# EasyEDA Pro project C8T6实验板.epro

# Schematic Schematic1
Create Date: 2023-04-12; Page Name: P1; Project Name: c8t6; Schematic Name: Schematic1; Update Date: 2023-06-14; Company: 嘉立创EDA; Page Size: A4; Version: V1.0
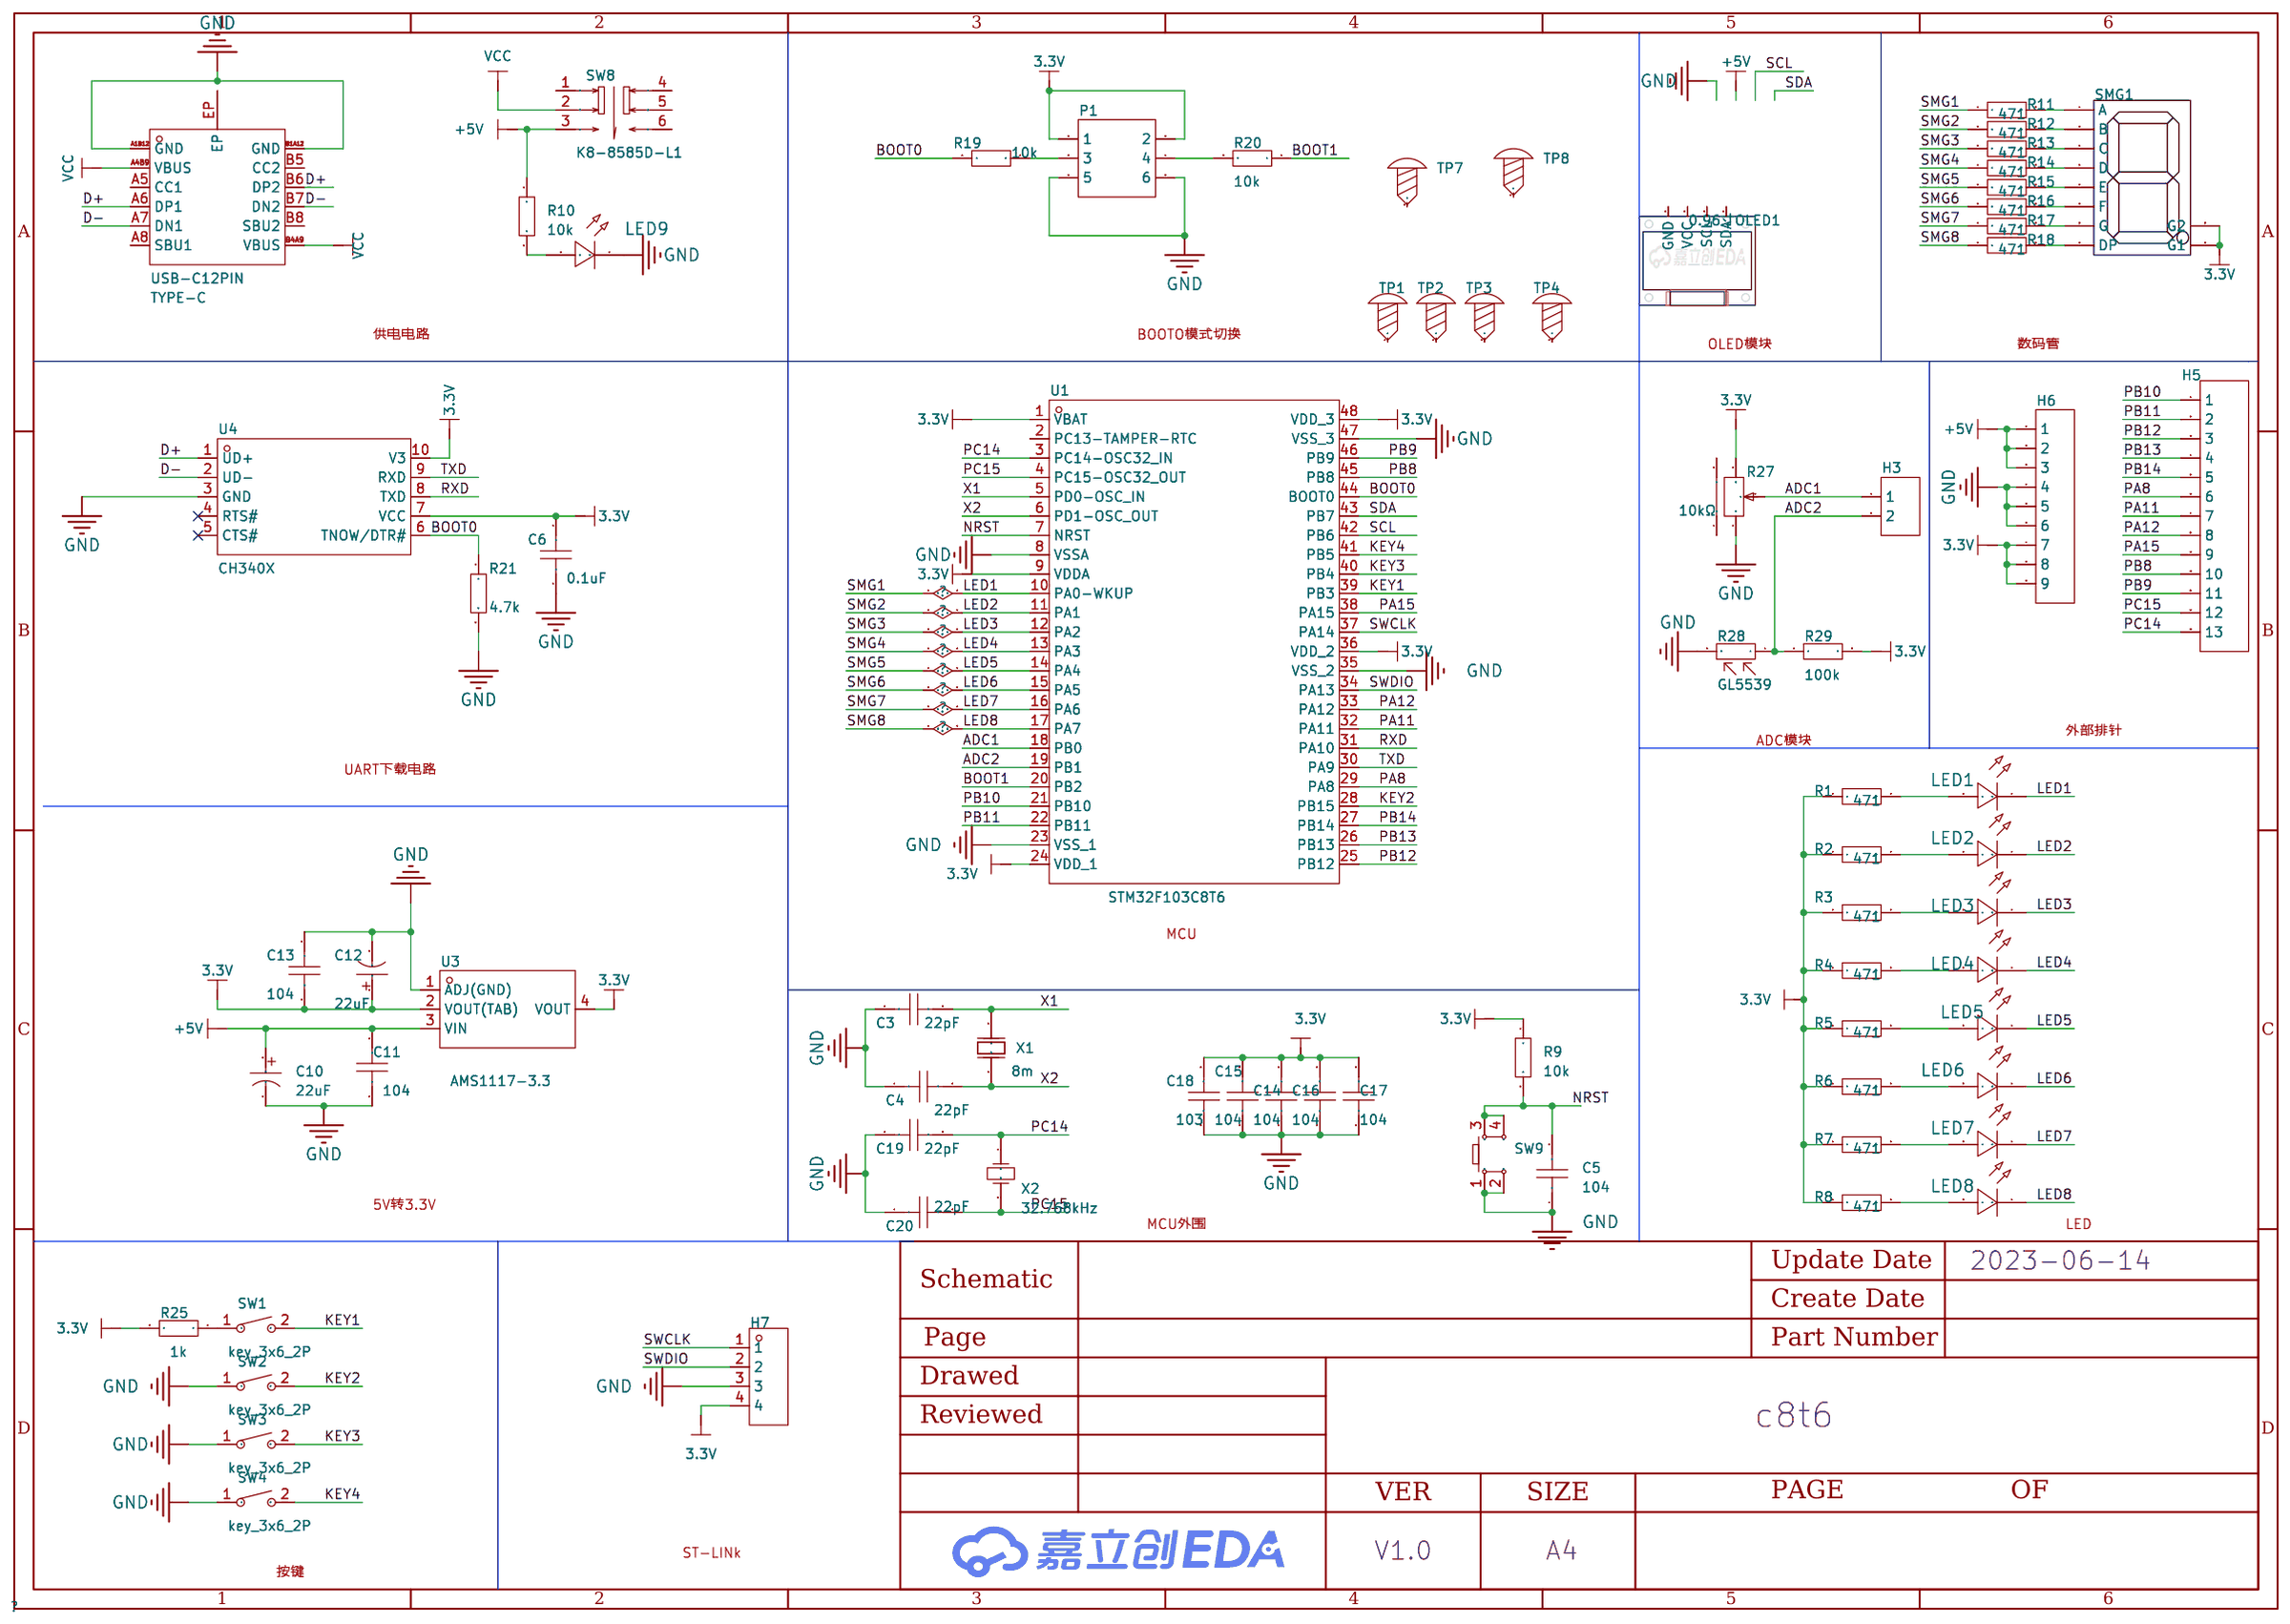
[diagram p0: schematic sheet]

## Parts
0.96寸OLED1  -  [0.96OLED_4P]
C3  22pF  [C0805]
C4  22pF  [C0805]
C5  104  [C0805]
C6  0.1uF  [C0805]
C10  22uF  [CAP-SMD_BD6.3-L6.6-W6.6-FD]
C11  104  [C0805]
C12  22uF  [CAP-SMD_BD6.3-L6.6-W6.6-FD]
C13  104  [C0805]
C14  104  [C0805]
C15  104  [C0805]
C16  104  [C0805]
C17  104  [C0805]
C18  103  [C0805]
C19  22pF  [C0805]
C20  22pF  [C0805]
H3  -  [HDR-TH_2P-P2.54-V-F]
H5  -  [HDR-TH_13P-P2.54-V-F]
H6  -  [HDR-TH_9P-P2.54-V-F-1]
H7  -  [HDR-TH_4P-P2.54-V-M]
LED1  -  [LED_0805]
LED2  -  [LED_0805]
LED3  -  [LED_0805]
LED4  -  [LED_0805]
LED5  -  [LED_0805]
LED6  -  [LED_0805]
LED7  -  [LED_0805]
LED8  -  [LED_0805]
LED9  -  [LED_0805]
P1  -  [HDR-TH_6P-P2.54-V-F-R2-C3-S2.54]
R1  471  [R0805]
R2  471  [R0805]
R3  471  [R0805]
R4  471  [R0805]
R5  471  [R0805]
R6  471  [R0805]
R7  471  [R0805]
R8  471  [R0805]
R9  10k  [R0805]
R10  10k  [R0805]
R11  471  [R0805]
R12  471  [R0805]
R13  471  [R0805]
R14  471  [R0805]
R15  471  [R0805]
R16  471  [R0805]
R17  471  [R0805]
R18  471  [R0805]
R19  10k  [R0805]
R20  10k  [R0805]
R21  4.7k  [R0805]
R25  1k  [R0805]
R27  10kΩ  [RES-ADJ-TH_RK09K1130AJ3]
R28  GL5539  [RES-TH_L5.1-W4.3-P3.40-D0.5]
R29  100k  [R0805]
SMG1  -  [LED-SEG-TH_10P-L12.6-W19.0-P2.54-S15.24-BL]
SW1  key_3x6_2P  [SW-SMD_L6.0-W3.5-LS8.0]
SW2  key_3x6_2P  [SW-SMD_L6.0-W3.5-LS8.0]
SW3  key_3x6_2P  [SW-SMD_L6.0-W3.5-LS8.0]
SW4  key_3x6_2P  [SW-SMD_L6.0-W3.5-LS8.0]
SW8  K8-8585D-L1  [KEY-TH_6P-L8.5-W8.5-P2.54]
SW9  -  [SW-SMD_4P-L6.0-W6.0-P4.50-LS9.0-2]
TP1  -  [M4螺丝]
TP2  -  [M4螺丝]
TP3  -  [M4螺丝]
TP4  -  [M4螺丝]
TP7  -  [M2螺丝]
TP8  -  [M2螺丝]
U1  STM32F103C8T6  [LQFP-48_L7.0-W7.0-P0.50-LS9.0-BL]
U3  AMS1117-3.3  [SOT-223_L6.5-W3.5-P2.30-LS7.0-BR]
U4  CH340X  [MSOP-10_L3.0-W3.0-P0.50-LS5.0-BL]
USB-C12PIN  TYPE-C  [USB-C-SMD_TYPE-C-16P-1]
X1  8m  [HC-49US_L11.5-W4.5-P4.88]
X2  32.768kHz  [OSC-TH_BD2.0-P0.70-D0.3]

## Library data of the parts
0.96寸OLED1 = 0.96OLED模块_4P: Supplier Footprint: 插件
C3-C6 C11 C13-C20 = CAP_0603: Supplier Footprint: 0603
C10 C12 = CK0J221M-CRE54_C3001236: 容值:220uF;精度:±20%;额定电压:6.3V;纹波电流:67mA@120Hz;; LCSC Part Name: 220uF ±20% 6.3V; Supplier Part: C3001236; Manufacturer: ROQANG(容强); Manufacturer Part: CK0J221M-CRE54; Supplier Footprint: SMD,D6.3xL5.4mm; JLCPCB Part Class: Extended Part; Datasheet: https://atta.szlcsc.com/upload/public/pdf/source/20220429/3961170169213FF6C34E47C660BD429F.pdf; Supplier: LCSC; Tolerance: ±20%; Rated Voltage: 6.3V; φD: 6.3mm; L: 5.4mm; Ripple Current: 67mA@120Hz; Lifetime @ Temp: 2000hrs@105℃; Operating Temperature: -55℃~+105℃
H3 = HDR-F_2.54_1x2P: Supplier Part: C49661; Supplier Footprint: 插件
H5 = HDR-F_2.54_1x13P: Supplier Part: C52709; Supplier Footprint: 插件
H6 = HDR-F_2.54_1x9P: Supplier Part: C39576; Supplier Footprint: 插件
H7 = HDR-M_2.54_1x4P: Supplier Part: C492403; Supplier Footprint: 插件
LED1-LED9 = LED_0603-R: Supplier Footprint: 0603
P1 = HDR-F_2.54_2x3: Supplier Part: C92272; Supplier Footprint: 插件
R1-R21 R25 R29 = Res_0603: Supplier Footprint: 0603
R27 = RK09K1130AP5: 阻值:10kΩ;精度:±20%;功率:50mW;; LCSC Part Name: 10kΩ ±20%; Supplier Part: C470295; Manufacturer: ALPSALPINE(阿尔卑斯阿尔派); Supplier Footprint: 插件; JLCPCB Part Class: 扩展库; Datasheet: https://atta.szlcsc.com/upload/public/pdf/source/20191216/C470295_B7C088B596733789BB6A603002A3F140.pdf; Supplier: LCSC; Tolerance: ±20%; Power(Watts): 50mW; Rated Voltage: 20V
R28 = GL5539: 光谱峰值(波长):540nm;最大电压:150V;亮电阻 @ 10Lux:30kΩ~90kΩ;暗电阻:10MΩ;; Supplier Part: C125630; Manufacturer: 森霸; Supplier Footprint: 插件,P=3mm; JLCPCB Part Class: 扩展库; Datasheet: https://atta.szlcsc.com/upload/public/pdf/source/20170810/C125630_1502335366924879946.pdf; Supplier: LCSC; Spectral Peak: 540nm; Applied Voltage: 150V; Illuminated Resistance @ 10Lux: 30kΩ~90kΩ; Dark Resistance: 10MΩ
SMG1 = LED_SEG_TH_0.56x1: Supplier Footprint: 插件
SW1-SW4 = key_3x6_2P: Supplier Part: C9900016923; JLCPCB Part Class: Extended Part; Datasheet: https://atta.szlcsc.comnull; Supplier: LCSC
SW8 = K8-8585D-L1: 触点电流:100mA;额定电压 (AC):-;额定电压 (DC):30V;绝缘电阻:100mΩ;安装方式:直插;自锁/无锁:自锁;按键形状:矩形柱塞;按键/盖帽颜色:黑色;带灯:无;引脚样式:PC引脚;作用力:240gf@±80gf;防护等级:-;工作温度:-25℃~+80℃;机械寿命:100000;; Supplier Part: C111758; Manufacturer: 韩国韩荣; Supplier Footprint: 插件; JLCPCB Part Class: 扩展库; Datasheet: https://atta.szlcsc.com/upload/public/pdf/source/20210810/2AEDE88915041A762602CF2B2D644A32.pdf; Supplier: LCSC; Contact Current: 100mA; Voltage Rating (DC): 30V; Insulation Resistance: 100mΩ; Mounting Style: 直插; Self Lock / No Lock: 自锁; Actuator Style: 矩形柱塞; Actuator/Cap Color: 黑色; With Lamp: 无; Pin Style: PC引脚; Operating Force: 240gf@±80gf; Operating Temperature: -25℃~+80℃; Mechanical Life: 100000
SW9 = Key_SMD_6x6x6.5: Supplier Footprint: SMD
TP1-TP4 = M4螺丝: Supplier Footprint: 插件
TP7 TP8 = M3螺丝: Supplier Footprint: 插件
U1 = STM32F103C8T6: 工作电压:2V ~ 3.6V;主频（MAX):72MHz;; Supplier Part: C8734; Manufacturer: ST(意法半导体); Supplier Footprint: LQFP-48_7x7x05P; JLCPCB Part Class: 基础库; Datasheet: https://atta.szlcsc.com/upload/public/pdf/source/20140724/1457707174202.pdf; Supplier: LCSC; UART/USART: 3 USART; USB Device: 1; PWM: 13; I2C（SMBUS/PMBUS）: 2; Voltage - Supply (Vcc/Vdd): 2V ~ 3.6V; CAN: 1; A/D: 10x12bit; Program Memory Size: 64KB; RAM Size: 20KB; Speed: 72MHz; Number of I/O: 37
U3 = AMS1117-3.3_C347256: 静态电流(Iq):-;输出类型:固定;最大输入电压:18V;输出电压(可调):-;压降(max):1.3V @ 1A;输出电压(固定):3.3V;; LCSC Part Name: 低压差线性稳压(LDO); Supplier Part: C347256; Manufacturer: UMW(友台半导体); Supplier Footprint: SOT-89; JLCPCB Part Class: 扩展库; Datasheet: https://atta.szlcsc.com/upload/public/pdf/source/20211011/50CC665C22E3A66C08379A4A74BDA25C.pdf; Supplier: LCSC; Ripple Rejection (PSRR): 60dB(120Hz); Output Configuration: 正; Current - Supply (Max): 10mA; Output Current (Max): 1A; Output Type: 固定; Number of Output Channels: 1; Operating Temperature: -40℃~125℃; Voltage - Input (Max): 18V; Voltage Dropout (Max): 1.3V @ 1A; Voltage - Output (Fixed): 3.3V
U4 = CH340X: Supplier Part: C3035748; Manufacturer: WCH(南京沁恒); Supplier Footprint: MSOP-10; JLCPCB Part Class: 扩展库; Datasheet: https://atta.szlcsc.comnull; Supplier: LCSC
USB-C12PIN = TYPE-C_C9900008394: Supplier Part: C9900008394; Supplier Footprint: TYPE-C-16P; JLCPCB Part Class: Extended Part; Datasheet: 2022-02-23/91586W/67ceeeb81a9f4c1f8ea00a3628213c3d/USBC16P.pdf; Supplier: LCSC
X1 = XIHCCCNANF-11.0592: 频率:-;负载电容:-;; Supplier Part: C358645; Manufacturer: TAITIEN(泰艺电子); Supplier Footprint: HC-49S; JLCPCB Part Class: 扩展库; Datasheet: https://atta.szlcsc.com/upload/public/pdf/source/20190107/C358645_229D1BE99A621A695563BD15EF2D24F1.pdf; Supplier: LCSC
X2 = X206032768KGA2SC: 频率:32.768kHz;频率公差:±5ppm;负载电容:12.5pF;; LCSC Part Name: 32.768kHz ±5ppm 12.5pF YT-26; Supplier Part: C13712; Manufacturer: YXC(扬兴晶振); Supplier Footprint: DT-26; JLCPCB Part Class: Extended Part; Datasheet: https://atta.szlcsc.com/upload/public/pdf/source/20210329/C13712_F7F11DC87370623B2CDEB0B445E6F76E.pdf; Supplier: LCSC; Crystal Type: 圆柱体晶振; Frequency Tolerance: ±5ppm; Load Capacitance: 12.5pF; Operating Temperature: -20℃~+70℃

## Nets
3.3V: C6.2 C12.1 C13.2 C14.2 C15.2 C16.2 C17.2 C18.2 H6.7 H6.8 H6.9 H7.4 P1.1 P1.2 R1.1 R2.1 R3.1 R4.1 R5.1 R6.1 R7.1 R8.1 R9.1 R25.2 R27.3 R29.2 SMG1.3(G1) SMG1.8(G2) U1.1(VBAT) U1.9(VDDA) U1.24(VDD_1) U1.36(VDD_2) U1.48(VDD_3) U3.2(VOUT(TAB)) U3.4(VOUT) U4.7(VCC) U4.10(V3)
+5V: C10.1 C11.2 H6.1 H6.2 H6.3 R10.1 SW8.3 U3.3(VIN)
GND: C3.1 C4.1 C5.1 C6.1 C10.2 C11.1 C12.2 C13.1 C14.1 C15.1 C16.1 C17.1 C18.1 C19.1 C20.1 H6.4 H6.5 H6.6 H7.3 LED9.1(C) P1.5 P1.6 R21.2 R27.1 R28.2 SW2.1 SW3.1 SW4.1 SW9.1 SW9.2 U1.8(VSSA) U1.23(VSS_1) U1.35(VSS_2) U1.47(VSS_3) U3.1(ADJ(GND)) U4.3(GND) USB-C12PIN.A1B12(GND) USB-C12PIN.B1A12(GND)
VCC: SW8.2 USB-C12PIN.A4B9(VBUS) USB-C12PIN.B4A9(VBUS)
ADC1: H3.1 R27.2 U1.18(PB0)
ADC2: H3.2 R28.1 R29.1 U1.19(PB1)
BOOT0: R19.2 R21.1 U1.44(BOOT0) U4.6(TNOW/DTR#)
BOOT1: R20.1 U1.20(PB2)
D+: U4.1(UD+) USB-C12PIN.A6(DP1) USB-C12PIN.B6(DP2)
D-: U4.2(UD-) USB-C12PIN.A7(DN1) USB-C12PIN.B7(DN2)
KEY1: SW1.2 U1.39(PB3)
KEY2: SW2.2 U1.28(PB15)
KEY3: SW3.2 U1.40(PB4)
KEY4: SW4.2 U1.41(PB5)
LED1: LED1.1(C) R11.1 U1.10(PA0-WKUP)
LED2: LED2.1(C) R12.1 U1.11(PA1)
LED3: LED3.1(C) R13.1 U1.12(PA2)
LED4: LED4.1(C) R14.1 U1.13(PA3)
LED5: LED5.1(C) R15.1 U1.14(PA4)
LED6: LED6.1(C) R16.1 U1.15(PA5)
LED7: LED7.1(C) R17.1 U1.16(PA6)
LED8: LED8.1(C) R18.1 U1.17(PA7)
NRST: C5.2 R9.2 SW9.3 SW9.4 U1.7(NRST)
PA8: H5.6 U1.29(PA8)
PA11: H5.7 U1.32(PA11)
PA12: H5.8 U1.33(PA12)
PA15: H5.9 U1.38(PA15)
PB8: H5.10 U1.45(PB8)
PB9: H5.11 U1.46(PB9)
PB10: H5.1 U1.21(PB10)
PB11: H5.2 U1.22(PB11)
PB12: H5.3 U1.25(PB12)
PB13: H5.4 U1.26(PB13)
PB14: H5.5 U1.27(PB14)
PC14: C19.2 H5.13 U1.3(PC14-OSC32_IN) X2.1(OSC1)
PC15: C20.2 H5.12 U1.4(PC15-OSC32_OUT) X2.2(OSC2)
RXD: U1.31(PA10) U4.8(TXD)
SCL: U1.42(PB6)
SDA: U1.43(PB7)
SWCLK: H7.1 U1.37(PA14)
SWDIO: H7.2 U1.34(PA13)
TXD: U1.30(PA9) U4.9(RXD)
X1: C3.2 U1.5(PD0-OSC_IN) X1.2(OSC2)
X2: C4.2 U1.6(PD1-OSC_OUT) X1.1(OSC1)
$1N4226: LED8.2(A) R8.2
$1N4235: LED7.2(A) R7.2
$1N4268: LED6.2(A) R6.2
$1N4277: LED5.2(A) R5.2
$1N4286: LED4.2(A) R4.2
$1N4295: LED3.2(A) R3.2
$1N4304: LED2.2(A) R2.2
$1N4313: LED1.2(A) R1.2
$1N16470: LED9.2(A) R10.2
$1N16926: R11.2 SMG1.7(A)
$1N16964: R12.2 SMG1.6(B)
$1N17004: R13.2 SMG1.4(C)
$1N17005: R14.2 SMG1.2(D)
$1N17044: R15.2 SMG1.1(E)
$1N17045: R16.2 SMG1.9(F)
$1N17084: R17.2 SMG1.10(G)
$1N17085: R18.2 SMG1.5(DP)
$1N20402: P1.3 R19.1
$1N20442: P1.4 R20.2
$1N93867: R25.1 SW1.1

Not connected (* = marked no-connect by the designer): 0.96寸OLED1 1(GND) 2(VCC) 3(SCL) 4(SDA); R27 4 5; SW8 1 4 5 6; TP1 1; TP2 1; TP3 1; TP4 1; TP7 1; TP8 1; U1 2(PC13-TAMPER-RTC); U4 4(RTS#)* 5(CTS#)*; USB-C12PIN A5(CC1) A8(SBU1) B5(CC2) B8(SBU2) EP

## Notes on the sheet
- 供电电路
- BOOTO模式切换
- OLED模块
- 数码管
- ADC模块
- 外部排针
- UART下载电路
- MCU
- 5V转3.3V
- MCU外围
- LED
- ST-LINk
- 按键

# Board PCB1
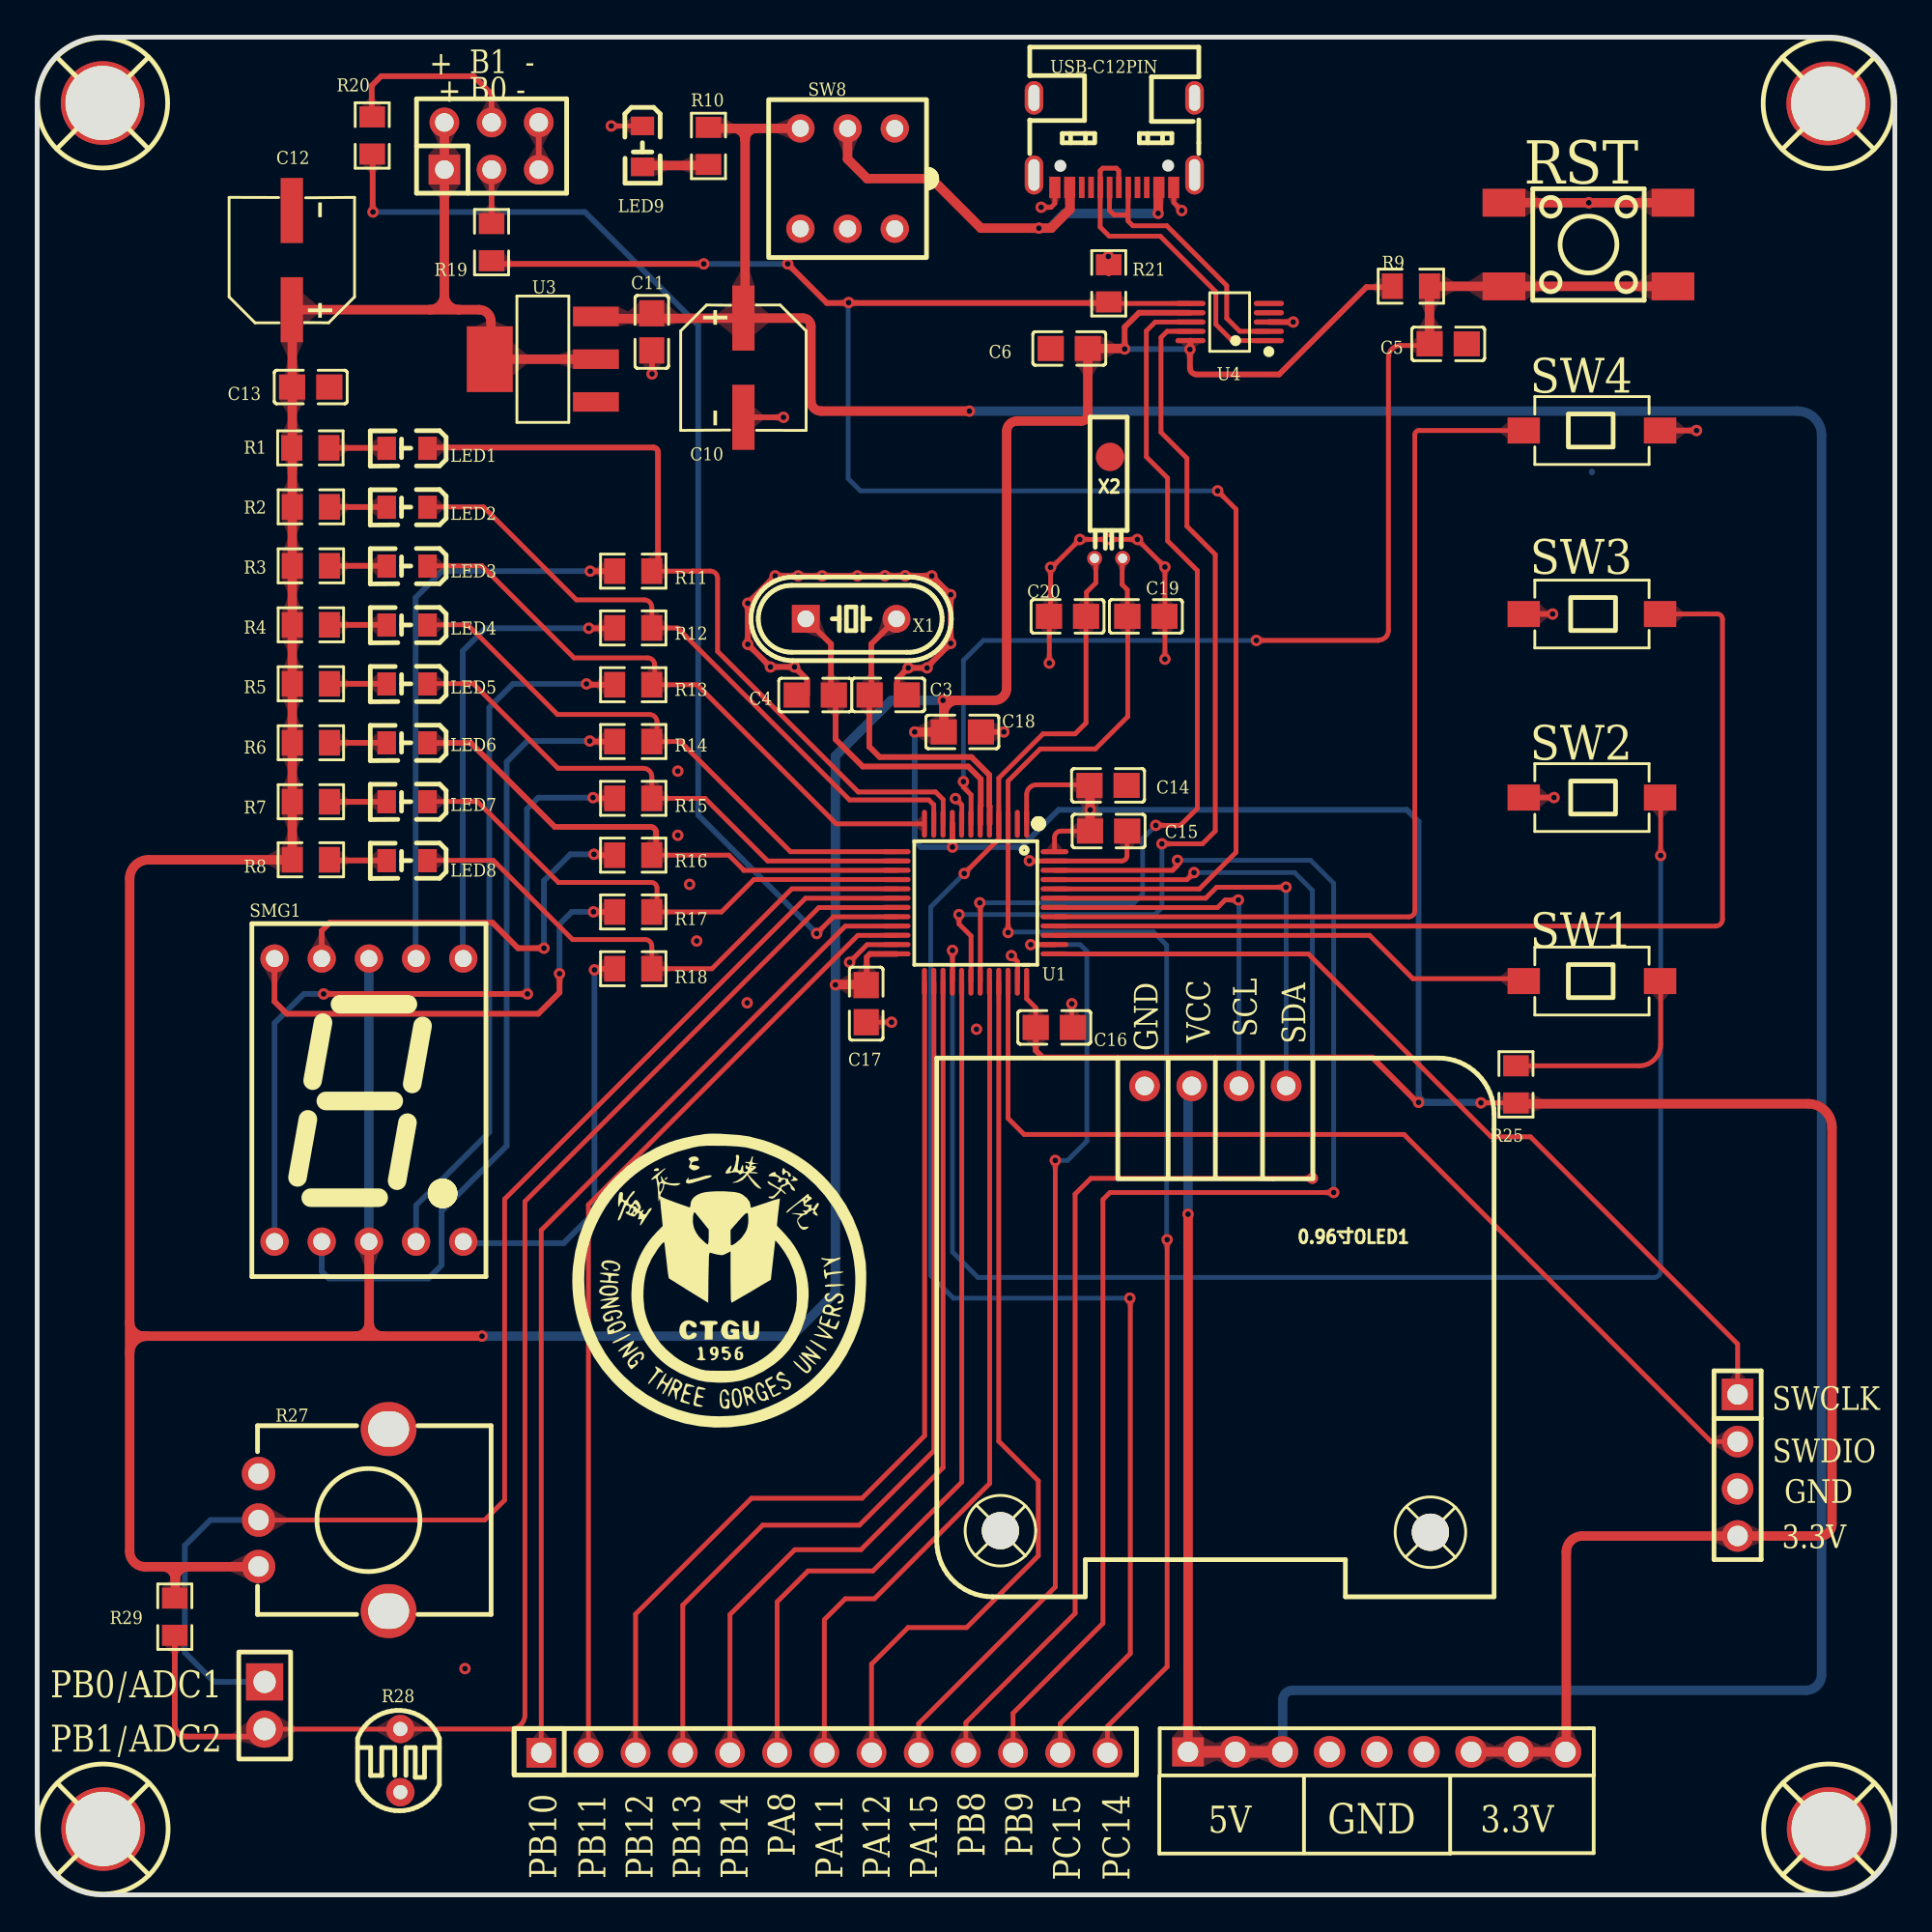
[diagram p1: board, top side]
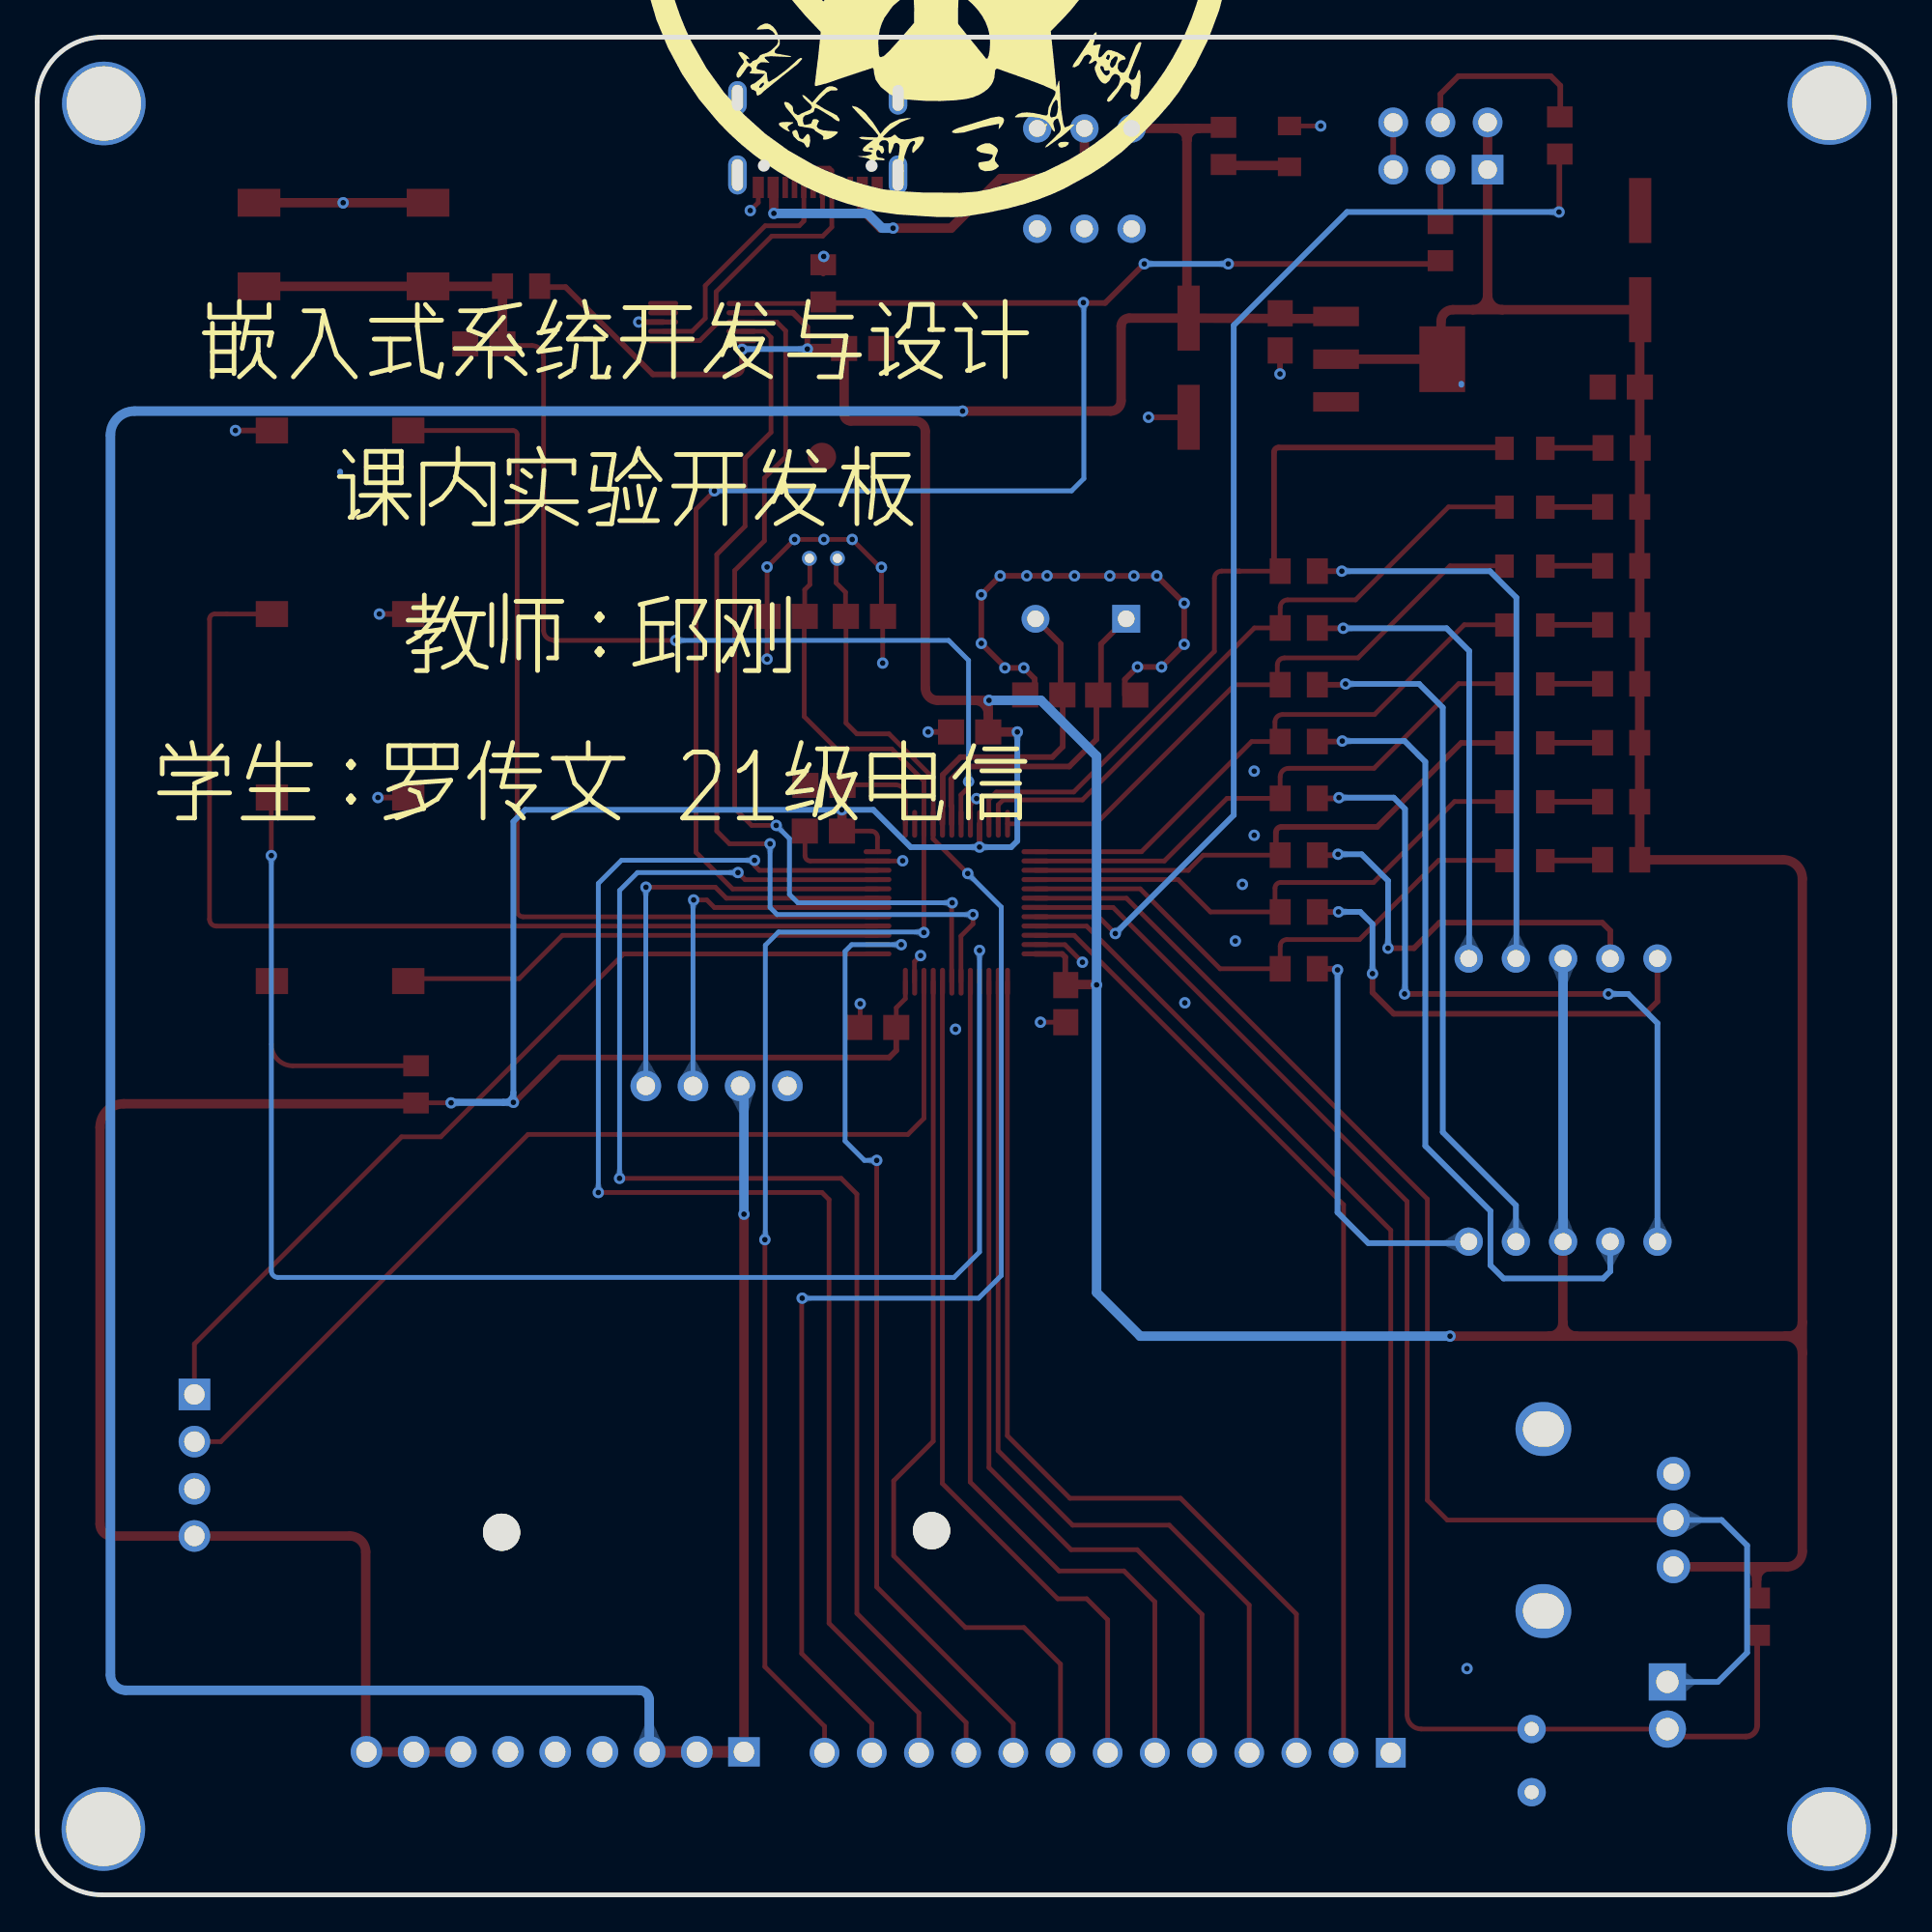
[diagram p2: board, bottom side, seen from below]

Outline 100 x 100 mm; copper layers: Top Layer, Bottom Layer. Coordinates in mm from the lower left corner of the outline.
Outline path: 0,96.5 0,3.5 arc(1.03,1.03) 3.5,0 96.5,0 arc(98.97,1.03) 100,3.5 100,96.5 arc(98.97,98.97) 96.5,100 3.5,100 arc(1.03,98.97) 0,96.5
Stack: Top Layer 0.035mm / Dielectric1 1.51mm FR4 er 4.5 / Bottom Layer 0.035mm

## Design rules (mm)
template: 用户自定义配置
spacing safeClearance (default): track to track 0.152, other pairs 0.152 to 0.3
track width trackWidth (default): min 0.127, default 0.254, max 2.54
differential pair differentialPair (default): width min 0.127, default 0.254, max 2.54; gap min 0.152, default 0.152
via viaSize (default): diameter min 0.5, default 0.61, max 10; hole min 0.3, default 0.305, max 6

## Placement (name value [footprint] x y rotation side)
0.96寸OLED1  -  [0.96OLED_4P]  63.43 43.54 0 top
C3  22pF  [C0805]  45.81 64.59 180 top
C4  22pF  [C0805]  41.89 64.59 0 top
C5  104  [C0805]  75.96 83.49 180 top
C6  0.1uF  [C0805]  55.56 83.24 0 top
C10  22uF  [CAP-SMD_BD6.3-L6.6-W6.6-FD]  38.02 82.21 270 top
C11  104  [C0805]  33.09 84.14 90 top
C12  22uF  [CAP-SMD_BD6.3-L6.6-W6.6-FD]  13.71 88 90 top
C13  104  [C0805]  14.73 81.17 180 top
C14  104  [C0805]  57.65 59.72 180 top
C15  104  [C0805]  57.68 57.26 180 top
C16  104  [C0805]  54.75 46.69 180 top
C17  104  [C0805]  44.63 47.97 90 top
C18  103  [C0805]  49.8 62.6 180 top
C19  22pF  [C0805]  59.68 68.82 180 top
C20  22pF  [C0805]  55.47 68.82 0 top
H3  -  [HDR-TH_2P-P2.54-V-F]  12.24 10.19 270 top
H5  -  [HDR-TH_13P-P2.54-V-F]  42.37 7.65 0 top
H6  -  [HDR-TH_9P-P2.54-V-F-1]  72.11 7.7 0 top
H7  -  [HDR-TH_4P-P2.54-V-M]  91.53 23.13 270 top
LED1  -  [LED_0805]  19.86 77.87 180 top
LED2  -  [LED_0805]  19.86 74.7 180 top
LED3  -  [LED_0805]  19.86 71.53 180 top
LED4  -  [LED_0805]  19.86 68.36 180 top
LED5  -  [LED_0805]  19.86 65.19 180 top
LED6  -  [LED_0805]  19.86 62.02 180 top
LED7  -  [LED_0805]  19.86 58.85 180 top
LED8  -  [LED_0805]  19.86 55.67 180 top
LED9  -  [LED_0805]  32.58 94.07 270 top
NOREF  -  [Pad_e2621]  57.75 77.41 0 top
P1  -  [HDR-TH_6P-P2.54-V-F-R2-C3-S2.54]  24.46 94.14 0 top
R1  471  [R0805]  14.71 77.89 0 top
R2  471  [R0805]  14.73 74.72 0 top
R3  471  [R0805]  14.73 71.54 0 top
R4  471  [R0805]  14.73 68.37 0 top
R5  471  [R0805]  14.73 65.19 0 top
R6  471  [R0805]  14.73 62.02 0 top
R7  471  [R0805]  14.73 58.84 0 top
R8  471  [R0805]  14.73 55.72 0 top
R9  10k  [R0805]  73.95 86.6 0 top
R10  10k  [R0805]  36.14 94.14 270 top
R11  471  [R0805]  32.09 71.25 180 top
R12  471  [R0805]  32.09 68.2 180 top
R13  471  [R0805]  32.09 65.14 180 top
R14  471  [R0805]  32.09 62.08 180 top
R15  471  [R0805]  32.09 59.02 180 top
R16  471  [R0805]  32.09 55.97 180 top
R17  471  [R0805]  32.09 52.91 180 top
R18  471  [R0805]  32.09 49.85 180 top
R19  10k  [R0805]  24.46 88.97 270 top
R20  10k  [R0805]  18.04 94.71 90 top
R21  4.7k  [R0805]  57.69 86.75 90 top
R25  1k  [R0805]  79.61 43.63 270 top
R27  10kΩ  [RES-ADJ-TH_RK09K1130AJ3]  15.42 20.17 270 top
R28  GL5539  [RES-TH_L5.1-W4.3-P3.40-D0.5]  19.55 7.23 0 top
R29  100k  [R0805]  7.41 14.97 90 top
RST  -  [SW-SMD_4P-L6.0-W6.0-P4.50-LS9.0-2]  83.51 88.84 0 top
SMG1  -  [LED-SEG-TH_10P-L12.6-W19.0-P2.54-S15.24-BL]  17.86 42.78 0 top
SW1  key_3x6_2P  [SW-SMD_L6.0-W3.5-LS8.0]  83.69 49.19 180 top
SW2  key_3x6_2P  [SW-SMD_L6.0-W3.5-LS8.0]  83.69 59.07 0 top
SW3  key_3x6_2P  [SW-SMD_L6.0-W3.5-LS8.0]  83.69 68.95 0 top
SW4  key_3x6_2P  [SW-SMD_L6.0-W3.5-LS8.0]  83.69 78.83 180 top
SW8  K8-8585D-L1  [KEY-TH_6P-L8.5-W8.5-P2.54]  43.63 92.39 180 top
TP1  -  [M4螺丝]  3.52 96.46 0 top
TP2  -  [M4螺丝]  3.55 3.54 0 top
TP3  -  [M4螺丝]  96.44 3.54 0 top
TP4  -  [M4螺丝]  96.41 96.43 0 top
TP7  -  [M2螺丝]  75 19.52 0 top
TP8  -  [M2螺丝]  51.85 19.6 0 top
U1  STM32F103C8T6  [LQFP-48_L7.0-W7.0-P0.50-LS9.0-BL]  50.51 53.4 180 top
U3  AMS1117-3.3  [SOT-223_L6.5-W3.5-P2.30-LS7.0-BR]  27.22 82.66 0 top
U4  CH340X  [MSOP-10_L3.0-W3.0-P0.50-LS5.0-BL]  64.19 84.66 90 top
USB-C12PIN  TYPE-C  [USB-C-SMD_TYPE-C-16P-1]  57.98 94.32 180 top
X1  8m  [HC-49US_L11.5-W4.5-P4.88]  43.82 68.69 0 top
X2  32.768kHz  [OSC-TH_BD2.0-P0.70-D0.3]  57.68 71.95 270 top

## Footprints (pads in the part's own frame, mm; a bottom-side part is the same pattern mirrored in y, then rotated)
0.96OLED_4P
  round 1.65 hole 1: 1(-3.81,-0.002) 2(-1.27,0.002) 3(1.27,0.002) 4(3.81,0.002)
C0805
  rect 1.41x1.35 smd: 1(-1,0) 2(1,0)
CAP-SMD_BD6.3-L6.6-W6.6-FD
  rect 3.5x1.2 smd: 1(-2.67,0) 2(2.67,0)
HC-49US_L11.5-W4.5-P4.88
  rect 1.5x1.5 hole 0.9: 1(-2.44,0)
  round 1.5 hole 0.9: 2(2.44,0)
HDR-TH_2P-P2.54-V-F
  rect 2x2 hole 1.2: 1(-1.27,0)
  round 2 hole 1.2: 2(1.27,0)
HDR-TH_4P-P2.54-V-M
  rect 1.7x1.7 hole 1.1: 1(-3.81,0)
  round 1.7 hole 1.1: 2(-1.27,0) 3(1.27,0) 4(3.81,0)
HDR-TH_6P-P2.54-V-F-R2-C3-S2.54
  rect 1.7x1.6 hole 1: 1(-2.54,-1.27)
  round 1.6 hole 1: 2(-2.54,1.27) 3(0,-1.27) 4(0,1.27) 5(2.54,-1.27) 6(2.54,1.27)
HDR-TH_9P-P2.54-V-F-1
  rect 1.7x1.575 hole 1.1: 1(-10.16,0)
  round 1.7 hole 1.1: 2(-7.62,0) 3(-5.08,0) 4(-2.54,0) 5(0,0) 6(2.54,0) 7(5.08,0) 8(7.62,0) 9(10.16,0)
HDR-TH_13P-P2.54-V-F
  rect 1.6x1.6 hole 1.1: 1(-15.24,0)
  round 1.6 hole 1.1: 2(-12.7,0) 3(-10.16,0) 4(-7.62,0) 5(-5.08,0) 6(-2.54,0) 7(0,0) 8(2.54,0) 9(5.08,0) 10(7.62,0) 11(10.16,0) 12(12.7,0) 13(15.24,0)
KEY-TH_6P-L8.5-W8.5-P2.54
  round 1.524 hole 0.914: 1(-2.54,-2.7) 2(0,-2.7) 3(2.54,-2.7) 4(-2.54,2.7) 5(0,2.7) 6(2.54,2.7)
LED-SEG-TH_10P-L12.6-W19.0-P2.54-S15.24-BL
  round 1.524 hole 0.914: 1(-5.08,-7.62) 2(-2.54,-7.62) 3(0,-7.62) 4(2.54,-7.62) 5(5.08,-7.62) 6(5.08,7.62) 7(2.54,7.62) 8(0,7.62) 9(-2.54,7.62) 10(-5.08,7.62)
LED_0805
  rect 1x1.25 smd: 1(-1.15,0.005) 2(1.05,0.005)
LQFP-48_L7.0-W7.0-P0.50-LS9.0-BL
  oval 0.27x1.5 smd: 1(-2.75,-4.25) 2(-2.25,-4.25) 3(-1.75,-4.25) 4(-1.25,-4.25) 5(-0.75,-4.25) 6(-0.25,-4.25) 7(0.25,-4.25) 8(0.75,-4.25) 9(1.25,-4.25) 10(1.75,-4.25) 11(2.25,-4.25) 12(2.75,-4.25) 25(2.75,4.25) 26(2.25,4.25) 27(1.75,4.25) 28(1.25,4.25) 29(0.75,4.25) 30(0.25,4.25) 31(-0.25,4.25) 32(-0.75,4.25) 33(-1.25,4.25) 34(-1.75,4.25) 35(-2.25,4.25) 36(-2.75,4.25)
  oval 1.5x0.27 smd: 13(4.25,-2.75) 14(4.25,-2.25) 15(4.25,-1.75) 16(4.25,-1.25) 17(4.25,-0.75) 18(4.25,-0.25) 19(4.25,0.25) 20(4.25,0.75) 21(4.25,1.25) 22(4.25,1.75) 23(4.25,2.25) 24(4.25,2.75) 37(-4.25,2.75) 38(-4.25,2.25) 39(-4.25,1.75) 40(-4.25,1.25) 41(-4.25,0.75) 42(-4.25,0.25) 43(-4.25,-0.25) 44(-4.25,-0.75) 45(-4.25,-1.25) 46(-4.25,-1.75) 47(-4.25,-2.25) 48(-4.25,-2.75)
M2螺丝
  round 2 hole 2: 1(0,0)
M4螺丝
  round 4.5 hole 4: 1(0,0)
MSOP-10_L3.0-W3.0-P0.50-LS5.0-BL
  oval 0.28x1.62 smd: 1(-1,-2.11) 2(-0.5,-2.11) 3(0,-2.11) 4(0.5,-2.11) 5(1,-2.11) 6(1,2.11) 7(0.5,2.11) 8(0,2.11) 9(-0.5,2.11) 10(-1,2.11)
OSC-TH_BD2.0-P0.70-D0.3
  round 0.8 hole 0.5: 1(0,0.754) 2(0,-0.754)
Pad_e2621
  round 1.524 smd: 1(0,0)
R0805
  rect 1.133x1.377 smd: 1(-1,0) 2(1,0)
RES-ADJ-TH_RK09K1130AJ3
  round 1.8 hole 1.1: 1(-2.5,-3.5) 2(0,-3.5) 3(2.5,-3.5)
  oval 2.9x3 hole 1.9x2.2: 4(-4.9,3.5) 5(4.9,3.5)
RES-TH_L5.1-W4.3-P3.40-D0.5
  round 1.524 hole 0.762: 1(0,1.7) 2(0,-1.7)
SOT-223_L6.5-W3.5-P2.30-LS7.0-BR
  rect 2.465x1.05 smd: 1(2.857,-2.3) 2(2.857,0) 3(2.857,2.3)
  rect 2.465x3.54 smd: 2(-2.857,0)
SW-SMD_4P-L6.0-W6.0-P4.50-LS9.0-2
  rect 2.3x1.5 smd: 1(-4.55,2.25) 2(4.55,2.25) 3(-4.55,-2.25) 4(4.55,-2.25)
SW-SMD_L6.0-W3.5-LS8.0
  rect 1.74x1.4 smd: 1(-3.67,0) 2(3.67,0)
USB-C-SMD_TYPE-C-16P-1
  rect 0.6x1.15 smd: A1B12(-3.2,2.41) A4B9(-2.4,2.41) B1A12(3.2,2.41) B4A9(2.4,2.41)
  rect 0.3x1.15 smd: A5(-1.25,2.41) A6(-0.25,2.41) A7(0.25,2.41) A8(1.25,2.41) B5(1.75,2.41) B6(0.75,2.41) B7(-0.75,2.41) B8(-1.75,2.41)
  oval 1x2.1 hole 0.6x1.7: EP(-4.32,1.74) EP(4.32,1.74)
  oval 1x1.8 hole 0.6x1.4: EP(-4.32,-2.41) EP(4.32,-2.41)

## Nets
As in the schematic, except:
3.3V: C6.2 C12.1 C13.2 C14.2 C15.2 C16.2 C17.2 C18.2 H6.7 H6.8 H6.9 H7.4 P1.1 P1.2 R1.1 R2.1 R3.1 R4.1 R5.1 R6.1 R7.1 R8.1 R9.1 R25.2 R27.3 R29.2 SMG1.3 SMG1.8 U1.1 U1.9 U1.24 U1.36 U1.48 U3.2 U4.7 U4.10
+5V: 0.96寸OLED1.2 C10.1 C11.2 H6.1 H6.2 H6.3 R10.1 SW8.3 U3.3
GND: 0.96寸OLED1.1 C3.1 C4.1 C5.1 C6.1 C10.2 C11.1 C12.2 C13.1 C14.1 C15.1 C16.1 C17.1 C18.1 C19.1 C20.1 H6.4 H6.5 H6.6 H7.3 LED9.1 P1.5 P1.6 R21.2 R27.1 R28.2 RST.1 RST.2 SW2.1 SW3.1 SW4.1 U1.8 U1.23 U1.35 U1.47 U3.1 U4.3 USB-C12PIN.A1B12 USB-C12PIN.B1A12
NRST: C5.2 R9.2 RST.3 RST.4 U1.7
SCL: 0.96寸OLED1.3 U1.42
SDA: 0.96寸OLED1.4 U1.43

Pads without a net: NOREF 1; R27 4 5; SW8 1 4 5 6; TP1 1; TP2 1; TP3 1; TP4 1; TP7 1; TP8 1; U1 2; U4 4 5; USB-C12PIN A5 A8 B5 B8 EP

## Via types
v1: diameter 0.61, hole 0.305, Top Layer to Bottom Layer, 99 vias

## Routing (per net, layer and track width the routed paths; a pad name or vN(x,y) marks a point on that pad's centre or on a via; arc(x,y) is an arc through that point)
3.3V: length 439.9
  Top Layer w0.254: v1(77.72,42.63) 79.87,42.63 arc(79.9,42.62) 79.92,42.58 ; R8.1 13.6,55.72 ; C16.2 53.75,47.75 53.26,48.24 U1.36 ; U1.48 54.76,56.92 arc(54.87,57.16) 55.11,57.26 C15.2 ; 56.58,59.75 53.79,59.75 arc(53.42,59.6) 53.26,59.23 U1.1
  Top Layer w0.305: 46.27,50.65 44.83,50.65 44.66,50.48 44.66,49.03 44.63,49 ; v1(58.54,83.21) 58.54,84.39 59.31,85.16 U4.7 ; 73.2,86.55 71.55,86.55 66.85,81.85 62.41,81.85 arc(62.16,81.95) 62.05,82.2 v1(62.05,83.19) 62.08,83.22 U4.10 ; 56.68,58.41 56.68,58.41 ; C16.2 53.75,45.45 54.13,45.07 71.88,45.07 74.29,42.66 v1(74.36,42.66) ; 49.27,57.65 v1(49.27,56.4)
  Top Layer w0.508: 13.94,85.33 21.13,85.33 ; 21.13,85.33 22.72,85.33 ; 21.13,85.33 arc(21.69,85.56) 21.92,86.12 ; 18.6,30.08 v1(23.95,30.08) ; 18.6,30.08 17.87,30.08 ; 18.6,30.08 arc(18.08,30.29) 17.87,30.8 ; SMG1.3 17.87,35.15 17.87,30.8 ; 17.87,30.08 17.87,30.8 ; 17.87,30.08 17.15,30.08 ; 17.87,30.8 arc(17.66,30.29) 17.15,30.08 ; v1(42.97,48.98) 42.99,49 44.63,49 ; 6.76,17.66 5.81,17.66 arc(5.22,17.9) 4.98,18.49 4.98,29.15 ; 6.76,17.66 8.12,17.66 ; 6.76,17.66 arc(7.24,17.46) 7.44,16.98 ; 48.8,63.57 48.8,64.11 arc(48.84,64.21) v1(48.76,64.3) 49.53,64.3 ; 48.8,63.57 C18.2 v1(47.24,62.6) ; 48.8,63.57 arc(49.02,64.09) 49.53,64.3 ; 8.12,17.66 11.91,17.66 R27.3 ; 8.12,17.66 arc(7.64,17.46) 7.44,16.98 ; C15.2 56.68,59.69 arc(56.67,59.71) C14.2 arc(56.61,59.73) 56.58,59.75 ; 17.15,30.08 5.9,30.08 ; C6.2 58.51,83.24 arc(58.53,83.23) v1(58.54,83.21) ; 49.53,64.3 51.53,64.3 arc(52,64.49) 52.19,64.96 52.19,78.78 arc(52.35,79.17) 52.75,79.34 56.2,79.34 arc(56.45,79.44) 56.56,79.69 56.56,83.24 ; H6.7 H6.8 H6.9 arc(82.3,7.71) 82.31,7.74 82.31,18.45 arc(82.57,19.06) 83.18,19.32 H7.4 95.98,19.32 arc(96.43,19.5) 96.62,19.95 96.62,41.31 arc(96.24,42.21) 95.34,42.58 79.65,42.58 arc(79.62,42.6) R25.2 ; 22.72,85.33 23.8,85.33 arc(24.24,85.14) 24.43,84.7 24.43,82.73 arc(24.41,82.68) U3.2 U3.2 ; 22.72,85.33 arc(22.15,85.56) 21.92,86.12 ; 4.98,30.83 4.98,54.69 arc(5.28,55.42) 6,55.72 13.6,55.72 13.57,55.74 ; 4.98,30.83 4.98,29.15 ; 4.98,30.83 arc(5.2,30.3) 5.74,30.08 5.9,30.08 ; P1.2 P1.1 21.92,86.12 ; 5.9,30.08 arc(5.25,29.81) 4.98,29.15 ; 7.41,15.73 R29.2 7.44,16 7.44,16.98 ; R8.1 R7.1 R6.1 R5.1 R4.1 R3.1 R2.1 13.73,85.3 arc(13.73,85.32) C12.1 ; 56.56,83.24 arc(56.56,83.24) 56.56,83.24
  Bottom Layer w0.305: v1(58.54,83.21) 62.03,83.21 v1(62.05,83.19) ; 74.36,43.19 v1(74.36,42.66) ; 74.36,43.19 74.36,57.77 73.73,58.41 v1(56.69,58.41) 54.98,58.41 52.98,56.4 v1(49.27,56.4) 47.57,56.4 47.24,56.73 v1(47.24,62.6) ; 74.36,43.19 arc(74.52,42.82) 74.9,42.66
  Bottom Layer w0.381: v1(74.36,42.66) 77.69,42.66 v1(77.72,42.63)
  Bottom Layer w0.508: v1(48.76,64.3) 45.97,64.3 42.97,61.3 v1(42.97,48.98) 42.97,32.42 40.62,30.08 v1(23.95,30.08) ; SMG1.3 SMG1.8
+5V: length 229.7
  Top Layer w0.508: C10.1 33.1,84.85 arc(33.09,84.85) 33.09,84.84 33.07,84.85 29.27,84.85 ; v1(50.18,79.87) 42.21,79.87 arc(41.81,80.03) 41.65,80.43 41.65,84.44 arc(41.52,84.75) 41.21,84.88 38.13,84.88 ; 38.11,95.09 37.49,95.09 ; 38.11,95.09 38.11,94.47 ; 38.11,95.09 38.72,95.09 ; 37.49,95.09 36.13,95.09 36.12,95.1 ; 37.49,95.09 arc(37.93,94.91) 38.11,94.47 ; 38.11,94.47 38.11,84.9 38.13,84.88 ; 38.11,94.47 38.11,94.47 ; 38.13,84.88 38.28,84.73 ; H6.1 v1(61.95,36.64) ; 38.11,94.47 arc(38.29,94.91) 38.72,95.09 ; SW8.3 38.72,95.09
  Top Layer w0.635: H6.3 H6.2 H6.1
  Bottom Layer w0.508: v1(61.95,36.64) 61.95,43.34 arc(62.01,43.48) 0.96寸OLED1.2 ; v1(50.18,79.87) 94.76,79.87 arc(95.68,79.49) 96.06,78.58 96.06,11.85 arc(95.81,11.26) 95.22,11.01 67.58,11.01 arc(67.21,10.85) 67.05,10.48 67.05,7.71 arc(67.04,7.7) H6.3
GND: length 89.2
  Top Layer w0.254: v1(49.43,59.01) 49.77,58.67 49.77,57.65 ; v1(60.71,66.52) v1(60.71,71.48) v1(59.23,72.96) v1(57.65,72.96) v1(56.13,72.96) 54.63,71.46 v1(54.55,71.46) 54.55,68.84 54.49,68.77 v1(54.49,66.31) ; USB-C12PIN.A1B12 61.18,91.1 v1(61.61,90.67) ; v1(54.04,90.84) 54.58,90.84 54.78,91.05 USB-C12PIN.B1A12 ; v1(52.44,50.56) 52.77,50.23 52.77,49.15 ; 46.27,51.15 44.68,51.15 v1(43.73,50.2) ; C17.1 v1(45.99,46.97) ; v1(55.7,47.97) 55.7,46.84 ; LED9.1 v1(30.91,95.22) ; C15.1 arc(58.67,57.26) 58.67,57.25 58.67,55.94 arc(58.58,55.74) 58.38,55.65 U1.47 53.42,55.65 arc(53.41,55.66) v1(53.41,55.66)
  Top Layer w0.305: SW4.1 v1(89.33,78.83) ; 57.69,87.27 57.69,88.17 v1(57.66,88.2) ; SW2.1 v1(81.65,59.07) ; v1(33.1,81.87) 33.1,83.42 33.09,83.44 ; 66.3,84.66 67.62,84.66 ; C10.2 v1(40.18,79.54) ; 50.48,62.6 v1(52.04,62.6) ; SW3.1 v1(81.58,68.95) ; 41.45,64.59 41.45,65.42 v1(40.77,66.1) v1(39.47,66.1) v1(38.25,67.32) v1(38.25,69.53) v1(39.73,71) v1(40.96,71) v1(42.26,71) v1(44.16,71) 44.16,71.01 v1(45.64,71.01) v1(46.73,71.01) 48.15,71.01 v1(48.16,71) v1(49.18,69.98) v1(49.18,67.37) 47.91,66.1 v1(47.91,66.05) v1(46.89,66.05) 46.3,65.46 46.3,64.59 ; P1.5 P1.6
  Top Layer w0.508: RST.1 v1(83.53,91.09) RST.2
  Bottom Layer w0.254: v1(45.99,46.97) 45.99,46.9 ; v1(56.13,72.96) 56.13,73.09 ; v1(30.91,95.22) 30.91,95.24 ; v1(57.65,72.96) 57.65,72.91 ; v1(54.55,71.46) 54.55,71.49 ; v1(60.71,71.48) 60.71,71.56 ; v1(60.71,66.52) 60.71,66.46 ; v1(59.23,72.96) 59.23,73.06
  Bottom Layer w0.305: v1(52.04,62.6) 52.04,62.65 ; v1(81.58,68.95) 81.58,68.87 ; 23.34,81.34 23.34,81.29 ; v1(40.96,71) 40.96,71.05 arc(40.96,71.05) 40.95,71.06 ; 83.69,76.61 83.69,76.59 83.68,76.58 ; v1(45.64,71.01) 45.64,71.05 arc(45.64,71.05) 45.64,71.06 ; v1(81.65,59.07) 81.65,59.02 ; v1(44.16,71) 44.16,71.03 ; v1(89.33,78.83) 89.33,78.78 ; v1(40.18,79.54) 40.18,79.64 ; v1(42.26,71) arc(42.26,71) 42.25,71.01
  Bottom Layer w0.508: v1(83.53,91.09) 83.53,91.02
  vias: v1(23.03,12.18) v1(34.49,60.49) v1(34.49,57.04) v1(35.12,54.39) v1(35.5,51.35) v1(38.22,48.02) v1(50.56,46.6) v1(67.62,84.67)
VCC: length 24.6
  Top Layer w0.508: 60.35,91.78 60.35,90.52 v1(60.34,90.51) ; SW8.2 43.63,93.44 44.68,92.39 48.13,92.39 50.8,89.72 v1(53.93,89.72) 54.59,89.72 55.6,90.73 55.6,91.78
  Bottom Layer w0.508: v1(60.34,90.51) 55.3,90.51 54.51,89.72 v1(53.93,89.72)
ADC1: length 73
  Top Layer w0.254: 46.27,53.65 41.36,53.65 25.16,37.45 25.16,21.25 24.09,20.17 R27.2
  Bottom Layer w0.305: R27.2 9.32,20.17 7.95,18.8 7.95,13.04 9.53,11.46 H3.1
ADC2: length 78.7
  Top Layer w0.254: 46.27,53.15 42.08,53.15 26.26,37.33 26.26,9.69 arc(26.03,9.15) 25.49,8.93 R28.1 19.55,8.92 H3.2
  Top Layer w0.305: 7.41,13.94 7.41,9.13 arc(7.59,8.7) 8.02,8.52 12.12,8.52 12.24,8.64
BOOT0: length 98.8
  Top Layer w0.254: v1(63.54,75.58) 64.53,74.59 64.53,56.12 62.56,54.15 54.77,54.15 ; U4.6 57.79,85.66 57.69,85.77
  Top Layer w0.305: R19.2 24.46,87.8 v1(35.88,87.8) ; v1(40.4,87.8) 42.51,85.69 57.61,85.69 57.69,85.77
  Bottom Layer w0.254: v1(63.54,75.58) 44.32,75.58 43.66,76.24 43.66,85.69 v1(43.68,85.71)
  Bottom Layer w0.305: v1(40.4,87.8) v1(35.88,87.8)
BOOT1: length 63
  Top Layer w0.254: 46.27,52.65 42.86,52.65 v1(41.96,51.75)
  Top Layer w0.305: 18.06,93.5 18.06,90.61 v1(18.08,90.59)
  Bottom Layer w0.305: v1(41.96,51.75) 35.59,58.12 35.59,84.49 29.49,90.59 v1(18.08,90.59)
D+: length 17.9
  Top Layer w0.254: 58.22,91.7 58.22,92.81 58.09,92.95 57.35,92.95 57.22,92.81 57.22,89.78 57.71,89.29 60.45,89.29 63.45,86.29 63.45,84.54 64.33,83.66 66.3,83.66
D-: length 15.3
  Top Layer w0.254: 58.73,90.66 58.73,91.7 58.72,91.7 ; 58.73,90.66 58.73,90.2 ; 58.73,90.66 arc(58.66,90.5) 58.5,90.43 ; 57.72,91.7 57.72,90.67 57.96,90.43 58.5,90.43 ; 58.73,90.2 58.73,90.1 58.98,89.85 60.81,89.85 64.03,86.62 64.03,84.87 64.74,84.16 66.3,84.16 ; 58.73,90.2 arc(58.66,90.36) 58.5,90.43
KEY1: length 26.3
  Top Layer w0.254: SW1.2 79.89,49.32 74.06,49.32 71.73,51.65 54.77,51.65
KEY2: length 82.3
  Top Layer w0.254: v1(87.39,55.94) 87.39,59.04 SW2.2 ; 49.27,49.15 v1(49.27,50.84)
  Bottom Layer w0.254: v1(49.27,50.84) 49.27,34.6 50.64,33.24 87.04,33.24 arc(87.29,33.34) 87.39,33.59 v1(87.39,55.94)
KEY3: length 55.8
  Top Layer w0.254: SW3.2 89.78,68.95 arc(89.78,68.95) 89.78,68.95 ; 89.78,68.95 90.44,68.95 arc(90.64,68.87) 90.72,68.67 90.72,52.51 arc(90.61,52.26) 90.36,52.15 54.77,52.15
KEY4: length 51.2
  Top Layer w0.254: SW4.2 74.39,78.83 arc(74.23,78.76) 74.16,78.6 74.16,52.97 arc(74.07,52.74) 73.84,52.65 54.77,52.65
LED1: length 44.1
  Top Layer w0.254: 35.66,71.26 35.28,71.26 arc(35.27,71.26) 35.27,71.25 ; 35.66,71.26 36.24,71.26 arc(36.51,71.15) 36.63,70.87 36.63,66.94 44.2,59.37 48.36,59.37 48.77,58.96 48.77,57.65 ; 35.66,71.26 35.27,71.25 ; 35.27,71.25 32.84,71.25
  Top Layer w0.305: 21.02,77.88 21.05,77.91 33.17,77.91 arc(33.35,77.84) 33.42,77.66 33.42,71.28 arc(33.41,71.26) 33.39,71.25
LED2: length 35.6
  Top Layer w0.254: LED2.1 21.03,74.71 24.02,74.71 29.03,69.71 32.68,69.71 arc(32.97,69.59) 33.09,69.31 R12.1 34.48,68.2 43.73,58.94 48,58.94 48.26,58.68 U1.11
LED3: length 33.5
  Top Layer w0.254: 20.87,71.54 23.94,71.54 28.9,66.59 32.86,66.59 arc(33.13,66.47) 33.24,66.2 33.24,65.14 arc(33.24,65.14) 33.24,65.14 ; 33.24,65.14 33.09,65.14 ; 33.24,65.14 35.53,65.14 43.01,57.65 U1.12
LED4: length 31.3
  Top Layer w0.254: 21.02,68.37 23.18,68.37 28.01,63.54 32.96,63.54 arc(33.25,63.42) 33.37,63.13 33.37,62.1 arc(33.38,62.09) 33.39,62.08 ; U1.13 40.55,56.15 34.62,62.08 R14.1
LED5: length 30
  Top Layer w0.254: LED5.1 21.03,65.2 23.48,65.2 28.03,60.64 32.63,60.64 arc(32.96,60.51) 33.09,60.19 33.09,59.03 arc(33.09,59.03) 33.09,59.02 35.95,59.02 39.32,55.65 U1.14
LED6: length 29.2
  Top Layer w0.254: 33.09,55.97 37.24,55.97 38.03,55.17 38.03,55.15 46.27,55.15
  Top Layer w0.305: 33.32,55.94 33.32,57.19 arc(33.23,57.4) 33.02,57.49 27.87,57.49 23.34,62.01 20.95,62.01 20.94,62 ; 33.32,55.94 arc(33.32,55.94) 33.32,55.94
LED7: length 29.5
  Top Layer w0.254: 33.37,52.91 R17.1 ; 33.37,52.91 36.84,52.91 38.58,54.65 U1.16 ; 33.37,52.91 33.37,54.19 arc(33.28,54.41) 33.06,54.5 28.06,54.5 23.7,58.86 20.99,58.86
LED8: length 30.2
  Top Layer w0.254: LED8.1 21.03,55.69 24.56,55.69 28.82,51.42 32.73,51.42 arc(32.98,51.32) 33.09,51.07 R18.1 36.32,49.85 40.62,54.15 U1.17
NRST: length 66
  Top Layer w0.254: v1(65.63,67.53) 72.21,67.53 72.23,67.55 arc(72.59,67.7) 72.74,68.06 72.74,82.77 arc(72.92,83.22) 73.37,83.4 74.86,83.4 ; v1(49.86,59.93) 49.86,59.62 50.27,59.21 50.27,57.65
  Top Layer w0.508: RST.4 RST.3 74.96,86.59 arc(74.95,86.59) R9.2 74.95,83.49 arc(74.95,83.49) C5.2
  Bottom Layer w0.254: v1(65.63,67.53) 50.93,67.53 49.86,66.45 v1(49.86,59.93)
PA8: length 47.7
  Top Layer w0.254: 49.77,49.15 49.77,22.22 44.99,17.44 41.5,17.44 39.83,15.78 H5.6
PA11: length 46.1
  Top Layer w0.254: 51.27,49.15 51.27,22.14 45.07,15.94 43.5,15.94 42.37,14.81 H5.7
PA12: length 47.9
  Top Layer w0.254: U1.33 51.76,24.42 53.89,22.29 53.89,18.25 50.03,14.39 46.88,14.39 44.91,12.42 H5.8
PA15: length 51.7
  Top Layer w0.254: H5.9 47.45,9.22 54.81,16.57 v1(54.81,39.53) ; 54.77,51.15 v1(53.49,51.15)
  Bottom Layer w0.254: v1(54.81,39.53) 55.47,39.53 56.51,40.58 56.51,50.79 56.15,51.15 v1(53.49,51.15)
PB8: length 75.6
  Top Layer w0.254: H5.10 49.99,9.27 55.87,15.15 55.87,37.72 56.72,38.57 v1(68.65,38.57) ; v1(62.27,55.03) 61.89,54.65 54.77,54.65
  Bottom Layer w0.254: v1(62.27,55.03) 67.68,55.03 68.65,54.06 v1(68.65,38.57)
PB9: length 76.9
  Top Layer w0.254: 54.77,55.15 61.12,55.15 61.38,55.41 v1(61.38,55.69) ; H5.11 52.53,9.78 57.37,14.62 57.37,37.43 57.75,37.81 v1(69.79,37.81)
  Bottom Layer w0.254: v1(69.79,37.81) 69.79,54.44 68.55,55.69 v1(61.38,55.69)
PB10: length 54
  Top Layer w0.254: H5.1 27.13,35.78 43.51,52.15 46.27,52.15
PB11: length 52.1
  Top Layer w0.254: 46.27,51.65 44.18,51.65 29.67,37.15 H5.2
PB12: length 51.4
  Top Layer w0.254: H5.3 32.21,15.11 38.45,21.35 44.41,21.35 47.77,24.71 47.77,49.15
PB13: length 50.1
  Top Layer w0.254: H5.4 34.75,15.6 39.06,19.9 44.26,19.9 48.27,23.91 48.27,49.15
PB14: length 48.3
  Top Layer w0.254: H5.5 37.29,15.09 40.79,18.58 44.34,18.58 48.76,23 U1.27
PC14: length 78.1
  Top Layer w0.254: H5.13 57.61,9.07 60.83,12.28 v1(60.83,35.27) ; U1.3 52.26,59.95 53.99,61.68 56.97,61.68 58.71,63.43 58.71,68.8 C19.2 58.68,70.25 58.41,70.53 58.41,71.72 ; v1(52.27,51.8) 52.27,57.65
  Bottom Layer w0.254: v1(60.83,35.27) 60.8,35.29 60.8,51.12 60.09,51.83 52.29,51.83 v1(52.27,51.8)
PC15: length 80.4
  Top Layer w0.254: v1(49.9,54.98) 51.77,56.85 51.77,57.65 ; U1.4 51.76,60.11 54.15,62.5 55.87,62.5 56.46,63.08 56.46,68.81 C20.2 56.49,68.84 56.49,70.12 56.99,70.62 56.99,71.76 ; v1(58.82,32.12) 58.84,32.14 58.84,12.99 55.07,9.22 H5.12
  Bottom Layer w0.254: v1(58.82,32.12) 49.32,32.12 48.1,33.34 48.1,53.17 v1(49.9,54.98)
RXD: length 49.2
  Top Layer w0.254: v1(50.74,53.4) 50.77,53.37 50.77,49.15 ; U4.8 60.19,84.66 59.71,84.19 59.71,77.41 60.85,76.26 60.85,72.89 62.45,71.28 62.45,58.48 61.54,57.57 v1(60.22,57.57)
  Bottom Layer w0.254: v1(50.74,53.4) 59.05,53.4 59.51,53.86 59.51,56.86 v1(60.22,57.57)
SCL: length 20
  Top Layer w0.254: 54.77,53.15 63.54,53.15 63.95,53.56 v1(64.66,53.56)
  Bottom Layer w0.254: 0.96寸OLED1.3 64.7,53.5
SDA: length 23.4
  Top Layer w0.254: v1(67.23,54.24) 63.49,54.24 62.9,53.65 54.77,53.65
  Bottom Layer w0.254: v1(67.23,54.24) 67.24,54.23 0.96寸OLED1.4
SWCLK: length 48.2
  Top Layer w0.254: H7.1 91.53,29.65 80.38,40.8 78.27,40.8 68.43,50.65 54.77,50.65
SWDIO: length 53.8
  Top Layer w0.254: U1.34 52.26,41.8 53.13,40.93 73.58,40.93 90.11,24.4 H7.2
TXD: length 51.1
  Top Layer w0.254: U4.9 60.83,84.16 60.5,83.83 60.5,78.73 61.89,77.33 61.89,73.67 63.42,72.15 63.42,57.26 62.73,56.58 v1(60.55,56.58) ; 50.27,49.15 50.27,51.61 49.62,52.26 v1(49.62,52.77)
  Bottom Layer w0.254: v1(60.55,56.58) 60.55,53.15 60.17,52.77 v1(49.62,52.77)
X1: length 17.2
  Top Layer w0.305: 51.27,57.65 51.27,58.6 51.25,58.62 51.25,60.29 50.29,61.25 45.35,61.25 44.79,61.81 44.79,64.48 44.9,64.59 44.9,67.33 X1.2
X2: length 18.2
  Top Layer w0.305: 50.77,57.65 50.77,58.6 50.79,58.62 50.79,60.06 50.12,60.74 44.44,60.74 42.98,62.2 42.98,64.48 42.87,64.59 42.85,64.59 42.85,64.59 ; 42.73,64.59 42.73,67.33 X1.1
$1N4226: length 3.3
  Top Layer w0.305: 15.49,55.67 15.5,55.68 18.8,55.68 LED8.2
$1N4235: length 3.3
  Top Layer w0.305: 15.49,58.84 18.81,58.84
$1N4268: length 3.6
  Top Layer w0.305: 15.49,62.02 18.82,62.02 ; 18.82,62.02 19.11,62.02 ; 18.82,62.02 LED6.2
$1N4277: length 3.3
  Top Layer w0.305: LED5.2 18.82,65.19 15.49,65.19
$1N4286: length 3.3
  Top Layer w0.305: 15.49,68.36 18.8,68.36 LED4.2
$1N4295: length 3.6
  Top Layer w0.305: 19.12,71.54 18.8,71.54 18.8,71.54 15.49,71.54
$1N4304: length 3.3
  Top Layer w0.305: 15.49,74.72 15.5,74.71 18.8,74.71 LED2.2
$1N4313: length 3.4
  Top Layer w0.305: 18.81,77.87 18.81,77.88 18.82,77.89 15.46,77.89
$1N16470: length 3.6
  Top Layer w0.508: 32.58,93.09 36.08,93.09 arc(36.12,93.11) R10.2
$1N16926: length 30.7
  Top Layer w0.305: v1(29.77,71.25) R11.2
  Bottom Layer w0.305: SMG1.7 20.37,50.43 20.37,69.83 21.8,71.25 v1(29.77,71.25)
$1N16964: length 25.3
  Top Layer w0.305: v1(29.69,68.18) 31.09,68.18 R12.2
  Bottom Layer w0.305: SMG1.6 22.91,50.43 22.91,66.96 24.13,68.18 v1(29.69,68.18)
$1N17004: length 37.7
  Top Layer w0.305: R13.2 29.61,65.14 v1(29.57,65.18)
  Bottom Layer w0.305: SMG1.4 20.4,37.12 24.34,41.05 24.34,63.91 25.61,65.18 v1(29.57,65.18)
$1N17005: length 43.3
  Top Layer w0.305: v1(29.75,62.11) 29.77,62.08 R14.2
  Bottom Layer w0.305: SMG1.2 15.32,33.56 15.7,33.18 21.06,33.18 21.77,33.89 21.77,36.81 25.28,40.32 25.28,60.99 26.39,62.11 v1(29.75,62.11)
$1N17044: length 41
  Top Layer w0.305: R15.2 29.96,59.02 v1(29.92,59.06) ; v1(15.42,48.5) v1(26.39,48.5)
  Bottom Layer w0.305: v1(26.39,48.5) 26.39,48.5 26.37,48.5 26.37,58.45 26.98,59.06 v1(29.92,59.06) ; v1(15.42,48.5) 14.35,48.5 12.78,46.92 SMG1.1
$1N17045: length 22.3
  Top Layer w0.305: v1(29.97,56.01) 30.02,55.97 R16.2 ; SMG1.9 15.32,51.9 15.75,52.33 24.51,52.33 25.88,50.96 v1(27.28,50.96)
  Bottom Layer w0.305: 27.26,50.93 v1(27.28,50.96) 27.28,54.59 28.7,56.01 v1(29.97,56.01)
$1N17084: length 25.3
  Top Layer w0.305: v1(29.95,52.92) 29.95,52.91 R17.2 ; v1(28.12,49.59) 28.12,48.57 26.98,47.43 13.44,47.43 12.78,48.09 SMG1.10
  Bottom Layer w0.305: v1(28.12,49.59) 28.12,52.25 28.78,52.92 v1(29.95,52.92)
$1N17085: length 21.9
  Top Layer w0.305: v1(30,49.79) 30.06,49.85 R18.2
  Bottom Layer w0.305: SMG1.5 23.01,35.08 28.35,35.08 30,36.74 v1(30,49.79)
$1N20402: length 2.5
  Top Layer w0.305: P1.3 24.46,90.38
$1N20442: length 10.3
  Top Layer w0.305: P1.4 24.46,96.93 23.5,97.9 18.52,97.9 18.01,97.39 18.01,95.73 R20.2
$1N93867: length 11.9
  Top Layer w0.254: R25.1 86.24,44.63 arc(87.06,44.97) 87.39,45.78 87.39,49.16 arc(87.39,49.18) SW1.1

## Copper pours and planes (outline as drawn; the poured copper is in the pictures)
GND on Top Layer: 0,99.98 100,99.98 100,-0.02 0,-0.02
GND on Bottom Layer: 0,99.98 100.15,99.98 100.15,-0.04 0,-0.04

Small or netless copper shapes (teardrops, artwork), in the pictures only: 343 on Top Layer, 62 on Bottom Layer

## Text on the board
Bottom Silkscreen Layer: 教师：邱刚 | 课内实验开发板 | 嵌入式系统开发与设计 | 学生：罗传文 21级电信
Top Silkscreen Layer: +  B1  - | + B0 - | SWCLK | SWDIO | 3.3V | GND | VCC | SCL | SDA | 5V | PB10 | PB11 | PB12 | PB13 | PB14 | PA8 | PA11 | PA12 | PA15 | PB8 | PB9 | PC15 | PC14 | PB0/ADC1 | PB1/ADC2
